# Altium schematic sheet PAGE117.SchDoc
size 246 x 182 mm
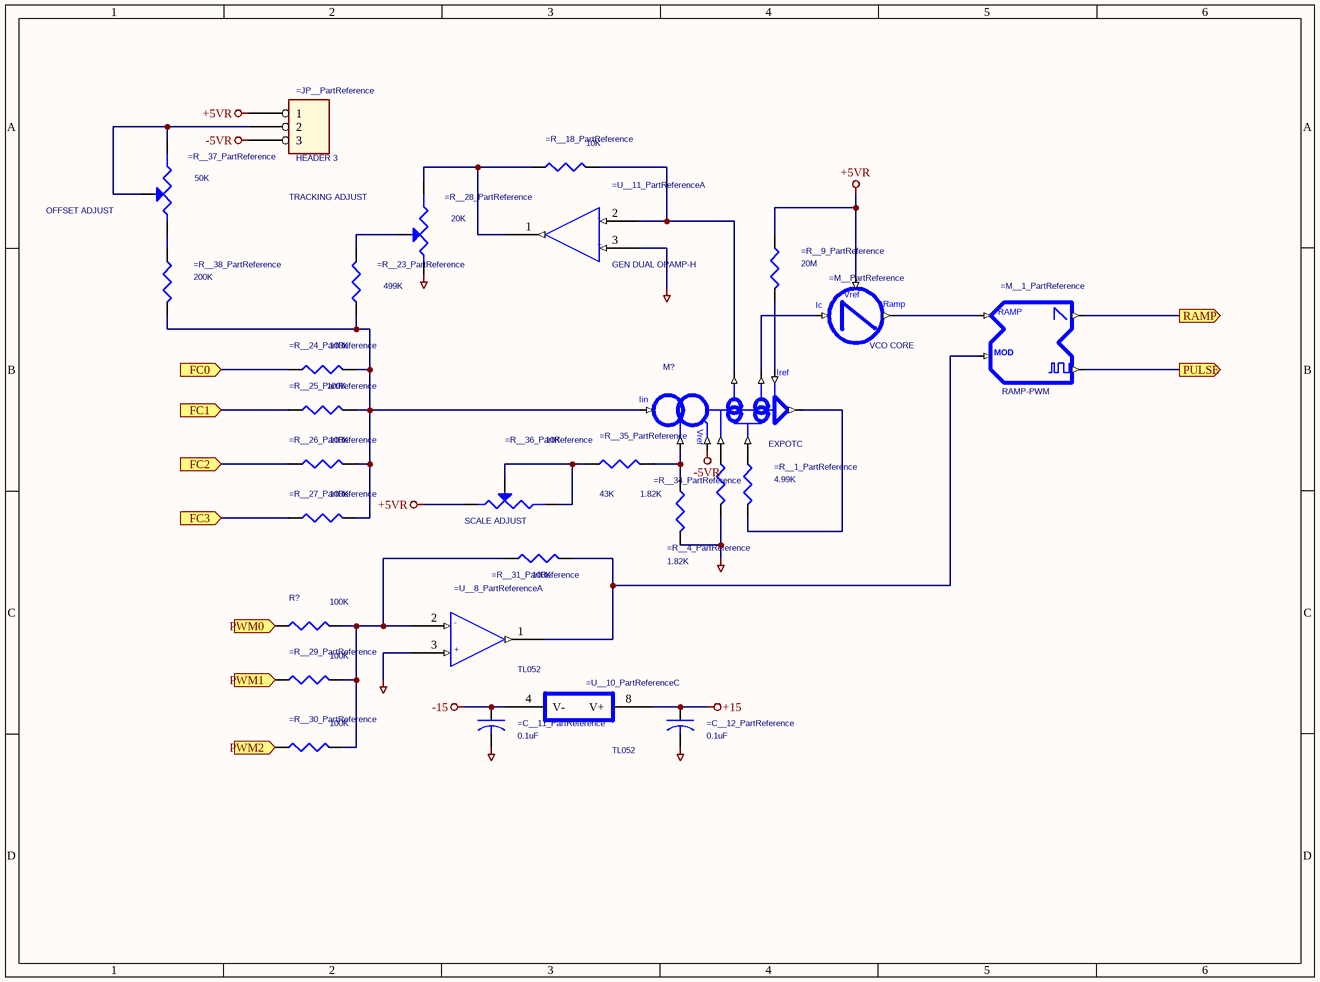
[diagram p0: PAGE117.SchDoc]

## Parts
=C__11_PartReference  0.1uF  [AXIALCAP0.3]
=C__12_PartReference  0.1uF  [AXIALCAP0.3]
=JP__PartReference  HEADER 3  [JP3]
=M__1_PartReference  RAMP-PWM
=M__PartReference  VCO CORE
=R__1_PartReference  4.99K  [AXIAL0.4]
=R__4_PartReference  1.82K  [AXIAL0.4]
=R__9_PartReference  20M  [AXIAL0.4]
=R__18_PartReference  10K  [AXIAL0.4]
=R__23_PartReference  499K  [AXIAL0.4]
=R__24_PartReference  100K  [AXIAL0.4]
=R__25_PartReference  100K  [AXIAL0.4]
=R__26_PartReference  100K  [AXIAL0.4]
=R__27_PartReference  100K  [AXIAL0.4]
=R__28_PartReference  20K  [TRIMPOT-3006]
=R__29_PartReference  100K  [AXIAL0.4]
=R__30_PartReference  100K  [AXIAL0.4]
=R__31_PartReference  100K  [AXIAL0.4]
=R__34_PartReference  1.82K  [AXIAL0.4]
=R__35_PartReference  43K  [AXIAL0.4]
=R__36_PartReference  10K  [TRIMPOT-3006]
=R__37_PartReference  50K  [TRIMPOT-3006]
=R__38_PartReference  200K  [AXIAL0.4]
=U__8_PartReference  TL052  [DIP8]  (part A of 3)
=U__10_PartReference  TL052  [DIP8]  (part C of 3)
=U__11_PartReference  GEN DUAL OPAMP-H  [DIP8]  (part A of 3)
M?  EXPOTC
R?  100K  [AXIAL0.4]

## Ports
FC0 (in), FC1 (in), FC2 (in), FC3 (in), PULSE (out), PWM0 (in), PWM1 (in), PWM2 (in), RAMP (out)

## Nets
+5VR: =JP__PartReference.1 =M__PartReference.VREF5P =R__9_PartReference.1 =R__36_PartReference.A
+15: =C__12_PartReference.1 =U__10_PartReference.8(V+)
-5VR: =JP__PartReference.3 M?.-VREF
-15: =C__11_PartReference.1 =U__10_PartReference.4(V-)
AGND: =C__11_PartReference.2 =C__12_PartReference.2 =R__4_PartReference.2 =R__28_PartReference.A =R__34_PartReference.2 =U__8_PartReference.3(+) =U__11_PartReference.3(+)
FC0: =R__24_PartReference.1 ; port FC0
FC1: =R__25_PartReference.1 ; port FC1
FC2: =R__26_PartReference.1 ; port FC2
FC3: =R__27_PartReference.1 ; port FC3
PULSE: =M__1_PartReference.PWMOUT ; port PULSE
PWM0: R?.1 ; port PWM0
PWM1: =R__29_PartReference.1 ; port PWM1
PWM2: =R__30_PartReference.1 ; port PWM2
RAMP: =M__1_PartReference.RAMPOUT ; port RAMP
Net=JP__PartReference_2: =JP__PartReference.2 =R__37_PartReference.B =R__37_PartReference.WIPER
Net=M__1_PartReference_PWMIN: =M__1_PartReference.PWMIN =R__31_PartReference.2 =U__8_PartReference.1(OUT)
Net=M__1_PartReference_RAMPIN: =M__1_PartReference.RAMPIN =M__PartReference.RAMP
Net=M__PartReference_Ic: =M__PartReference.Ic M?.Io2
Net=R__1_PartReference_1: =R__1_PartReference.1 M?.E
Net=R__1_PartReference_2: =R__1_PartReference.2 M?.O
Net=R__4_PartReference_1: =R__4_PartReference.1 M?.R
Net=R__9_PartReference_2: =R__9_PartReference.2 M?.Iref
Net=R__18_PartReference_1: =R__18_PartReference.1 =R__28_PartReference.B =U__11_PartReference.1(OUT)
Net=R__18_PartReference_2: =R__18_PartReference.2 =U__11_PartReference.2(-) M?.Io1
Net=R__23_PartReference_1: =R__23_PartReference.1 =R__24_PartReference.2 =R__25_PartReference.2 =R__26_PartReference.2 =R__27_PartReference.2 =R__38_PartReference.2 M?.Iin
Net=R__23_PartReference_2: =R__23_PartReference.2 =R__28_PartReference.WIPER
Net=R__29_PartReference_2: =R__29_PartReference.2 =R__30_PartReference.2 =R__31_PartReference.1 =U__8_PartReference.2(-) R?.2
Net=R__34_PartReference_1: =R__34_PartReference.1 =R__35_PartReference.2 M?.GAIN
Net=R__35_PartReference_1: =R__35_PartReference.1 =R__36_PartReference.B =R__36_PartReference.WIPER
Net=R__37_PartReference_A: =R__37_PartReference.A =R__38_PartReference.1

## Notes on the sheet
- OFFSET ADJUST
- TRACKING ADJUST
- (near =R__36_PartReference) SCALE ADJUST
- (in symbol EXPOTC) Vref
- (in symbol RAMP-PWM) RAMP; MOD
- (in symbol VCO CORE_0) Vref; Ramp

## Library data of the parts
=C__11_PartReference =C__12_PartReference = CAP_Dup1
=M__PartReference = VCO CORE_0: U__18_PartReference: =M__U__18_PartReference; C__23_PartReference: =M__C__23_PartReference; Q__12_PartReference: =M__Q__12_PartReference; U__19_PartReference: =M__U__19_PartReference; C__22_PartReference: =M__C__22_PartReference; C__24_PartReference: =M__C__24_PartReference; C__25_PartReference: =M__C__25_PartReference; C__26_PartReference: =M__C__26_PartReference; R__49_PartReference: =M__R__49_PartReference; C__27_PartReference: =M__C__27_PartReference; R__50_PartReference: =M__R__50_PartReference; R__47_PartReference: =M__R__47_PartReference; R__48_PartReference: =M__R__48_PartReference; TitleBlock_6_Page_Number: =M__TitleBlock_6_Page_Number
=R__1_PartReference =R__4_PartReference =R__9_PartReference =R__18_PartReference =R__23_PartReference =R__24_PartReference =R__25_PartReference =R__26_PartReference =R__27_PartReference =R__29_PartReference =R__30_PartReference =R__31_PartReference =R__34_PartReference =R__35_PartReference =R__38_PartReference R? = R_Dup1
=R__28_PartReference =R__36_PartReference =R__37_PartReference = POT
=U__8_PartReference =U__10_PartReference = GEN DUAL OPAMP-H
  =U__8_PartReference: PACKAGE: =U__8_PACKAGE
  =U__10_PartReference: PACKAGE: =U__10_PACKAGE
=M__1_PartReference = RAMP-PWM: M26_PartReference: =M__1_M26_PartReference; M26_PACKAGE: =M__1_M26_PACKAGE; D__PartReference: =M__1_D__PartReference; D__1_PartReference: =M__1_D__1_PartReference; M27_PartReference: =M__1_M27_PartReference; M27_PACKAGE: =M__1_M27_PACKAGE; C__PartReference: =M__1_C__PartReference; U__PartReference: =M__1_U__PartReference; U__PACKAGE: =M__1_U__PACKAGE; C__1_PartReference: =M__1_C__1_PartReference; R__7_PartReference: =M__1_R__7_PartReference; R__10_PartReference: =M__1_R__10_PartReference; R__11_PartReference: =M__1_R__11_PartReference; R__13_PartReference: =M__1_R__13_PartReference; R__20_PartReference: =M__1_R__20_PartReference; R__21_PartReference: =M__1_R__21_PartReference; R__22_PartReference: =M__1_R__22_PartReference; TitleBlock_Page_Number: =M__1_TitleBlock_Page_Number; TitleBlock_Title: =M__1_TitleBlock_Title
=U__11_PartReference = GEN DUAL OPAMP-H: PACKAGE: =U__11_PACKAGE